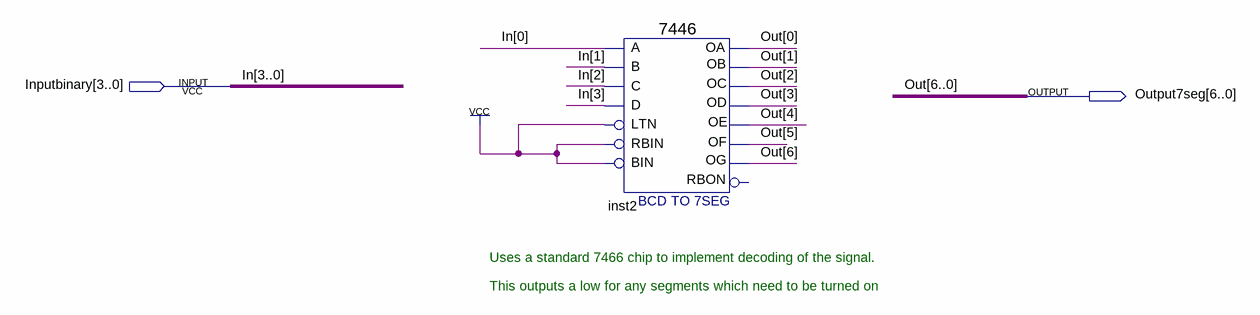
[diagram p0: schematic sheet]
// Quartus schematic decoder.bdf as structural Verilog: 1 symbols, 2 pins
module decoder (
  input  [3:0] Inputbinary,
  output [6:0] Output7seg
);

  \7446  inst2 (
    .D(Inputbinary[3]), .C(Inputbinary[2]), .B(Inputbinary[1]), .LTN(1'b1), .A(Inputbinary[0]), .RBIN(1'b1),
    .BIN(1'b1), .OC(Output7seg[2]), .OD(Output7seg[3]), .OE(Output7seg[4]), .OA(Output7seg[0]),
    .OB(Output7seg[1]), .OF(Output7seg[5]), .OG(Output7seg[6]));  // open: RBON

  // Other names for the same wires on the sheet: In[3:0] = Inputbinary; Out[6:0] = Output7seg

  // Notes on the sheet:
  //   Uses a standard 7466 chip to implement decoding of the signal.
  //   This outputs a low for any segments which need to be turned on
endmodule
